# Altium schematic sheet MR-71_RE0.SchDoc: MR-71-RE0
size A3; Address1: BM8132.r; Address2: Draw By: OldGerman; SheetNumber: 1; SheetTotal: 1
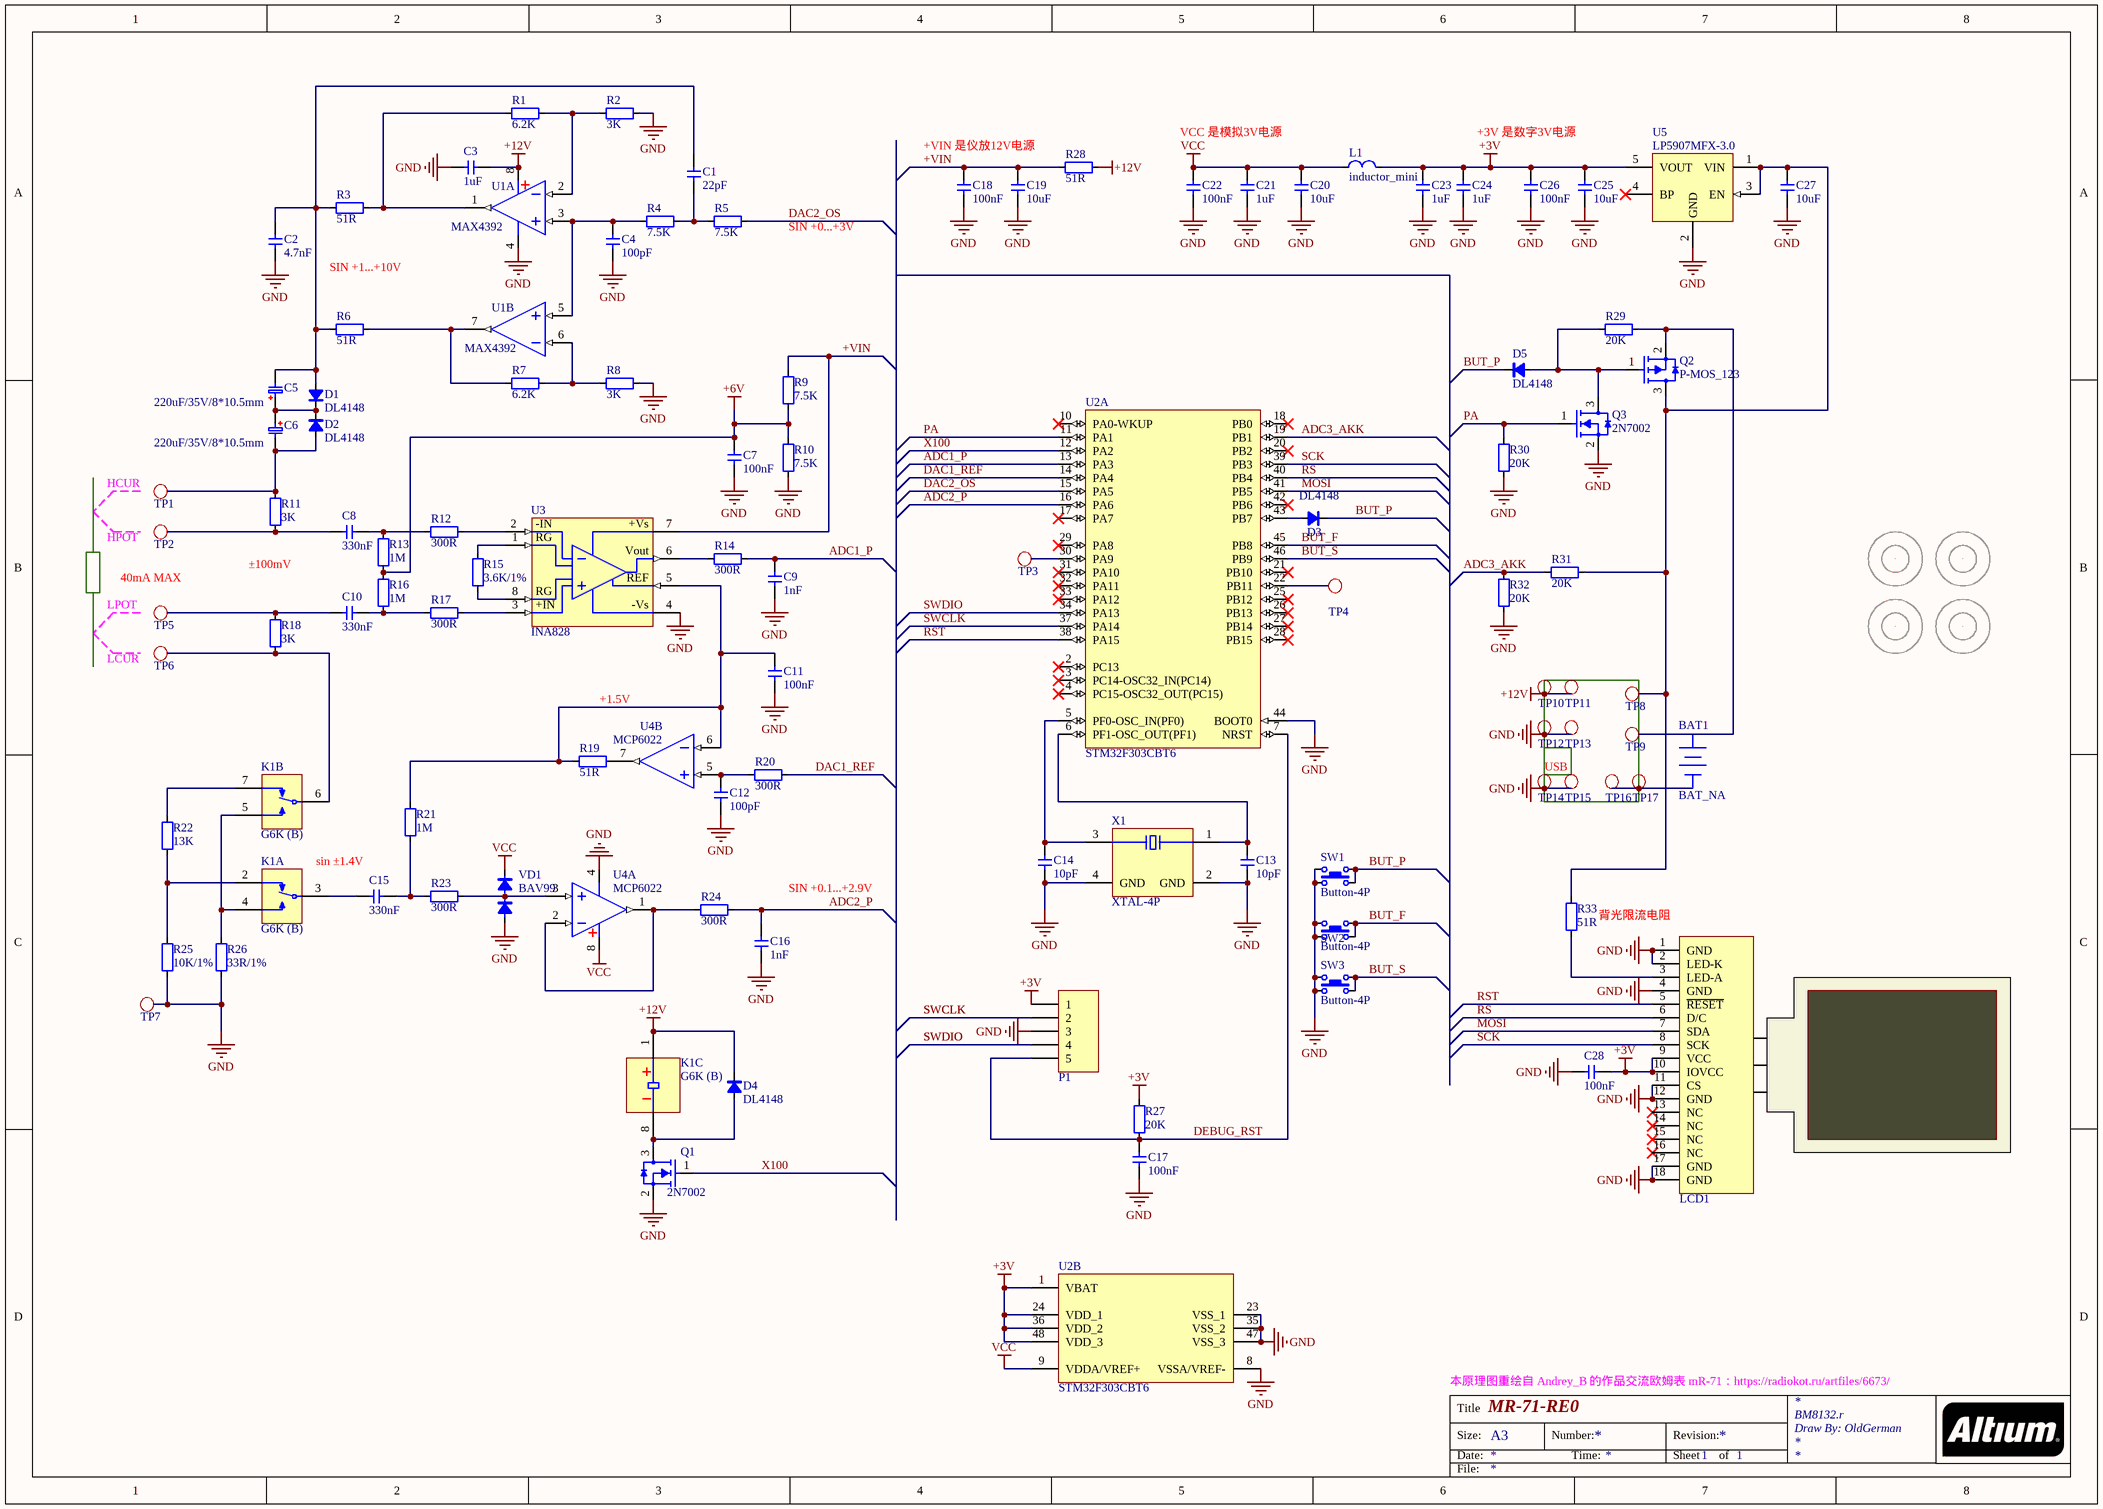
[diagram p0: MR-71_RE0.SchDoc]

## Parts
BAT1  BAT_NA  [Lipo_NONE]
C1  22pF  [C0805]
C2  4.7nF  [C0805]
C3  1uF  [C0805]
C4  100pF  [C0805]
C5  220uF/35V/8*10.5mm  [CAP OS-CON D=8.0 L=11.9 E12]
C6  220uF/35V/8*10.5mm  [CAP OS-CON D=8.0 L=11.9 E12]
C7  100nF  [C0805]
C8  330nF  [C0805]
C9  1nF  [C0805]
C10  330nF  [C0805]
C11  100nF  [C0805]
C12  100pF  [C0805]
C13  10pF  [C0805]
C14  10pF  [C0805]
C15  330nF  [C0805]
C16  1nF  [C0805]
C17  100nF  [C0805]
C18  100nF  [C0805]
C19  10uF  [C1206]
C20  10uF  [C1206]
C21  1uF  [C0805]
C22  100nF  [C0805]
C23  1uF  [C0805]
C24  1uF  [C0805]
C25  10uF  [C1206]
C26  100nF  [C0805]
C27  10uF  [C1206]
C28  100nF  [C0805]
D1  DL4148  [SOD-123]
D2  DL4148  [SOD-123]
D3  DL4148  [SOD-123]
D4  DL4148  [SOD-123]
D5  DL4148  [SOD-123]
H1  HOLE  [M3.1 D=5.8 SUN]  (value not drawn)
H2  HOLE  [M3.1 D=5.8 SUN]  (value not drawn)
H3  HOLE  [M3.1 D=5.8 SUN]  (value not drawn)
H4  HOLE  [M3.1 D=5.8 SUN]  (value not drawn)
K1  G6K (B)  [RELAY_G6K-2F-Y]  (parts A,B,C of 3)
L1  inductor_mini  [FER0805]
LCD1  LCD_Universal_128x160_18pin  [LCD-128X160-1.8INCH_SOLDER_MR-71]  (value not drawn)
P1  CONN_X5  [2.54MM_MALE_X5]  (value not drawn)
Q1  2N7002  [INFINEON SOT-23-3]
Q2  P-MOS_123  [INFINEON SOT-23-3]
Q3  2N7002  [INFINEON SOT-23-3]
R1  6.2K  [R0805]
R2  3K  [R0805]
R3  51R  [R0805]
R4  7.5K  [R0805]
R5  7.5K  [R0805]
R6  51R  [R0805]
R7  6.2K  [R0805]
R8  3K  [R0805]
R9  7.5K  [R0805]
R10  7.5K  [R0805]
R11  3K  [R0805]
R12  300R  [R0805]
R13  1M  [R0805]
R14  300R  [R0805]
R15  3.6K/1%  [R0805]
R16  1M  [R0805]
R17  300R  [R0805]
R18  3K  [R0805]
R19  51R  [R0805]
R20  300R  [R0805]
R21  1M  [R0805]
R22  13K  [R0805]
R23  300R  [R0805]
R24  300R  [R0805]
R25  10K/1%  [R0805]
R26  33R/1%  [R1206]
R27  20K  [R0805]
R28  51R  [R0805]
R29  20K  [R0805]
R30  20K  [R0805]
R31  20K  [R0805]
R32  20K  [R0805]
R33  51R  [R0805]
SW1  Button-4P  [TACTILE_SWITCH_SMD_4X4MM]
SW2  Button-4P  [TACTILE_SWITCH_SMD_4X4MM]
SW3  Button-4P  [TACTILE_SWITCH_SMD_4X4MM]
TP1  TP_SMD  [TP_SMD_1.5mm_01]  (value not drawn)  (no BOM)
TP2  TP_SMD  [TP_SMD_1.5mm_01]  (value not drawn)  (no BOM)
TP3  TP_SMD  [TP_SMD_1.5mm_01]  (value not drawn)  (no BOM)
TP4  TP_SMD  [TP_SMD_1.5mm_01]  (value not drawn)  (no BOM)
TP5  TP_SMD  [TP_SMD_1.5mm_01]  (value not drawn)  (no BOM)
TP6  TP_SMD  [TP_SMD_1.5mm_01]  (value not drawn)  (no BOM)
TP7  TP_SMD  [TP_SMD_1.5mm_01]  (value not drawn)  (no BOM)
TP8  TP_SMD  [TP_SMD_1.5mm_01]  (value not drawn)  (no BOM)
TP9  TP_SMD  [TP_SMD_1.5mm_01]  (value not drawn)  (no BOM)
TP10  TP_SMD  [KEYSTONE_5015]  (value not drawn)  (no BOM)
TP11  TP_SMD  [KEYSTONE_5015]  (value not drawn)  (no BOM)
TP12  TP_SMD  [KEYSTONE_5015]  (value not drawn)  (no BOM)
TP13  TP_SMD  [KEYSTONE_5015]  (value not drawn)  (no BOM)
TP14  TP_SMD  [KEYSTONE_5015]  (value not drawn)  (no BOM)
TP15  TP_SMD  [KEYSTONE_5015]  (value not drawn)  (no BOM)
TP16  TP_SMD  [KEYSTONE_5015]  (value not drawn)  (no BOM)
TP17  TP_SMD  [KEYSTONE_5015]  (value not drawn)  (no BOM)
U1  MAX4392  [ANALOG DEV SOIC-8 R8]  (parts A,B of 2)
U2  STM32F303CBT6  [ST LQFP-48 7x7MM]  (parts A,B of 2)
U3  INA828  [ANALOG DEV SOIC-8 R8]
U4  MCP6022  [ANALOG DEV SOIC-8 R8]  (parts A,B of 2)
U5  LP5907MFX-3.0  [ANALOG TSOT-23-5 UJ-5]
VD1  BAV99  [INFINEON SOT-23-3]
X1  XTAL-4P  [EPSON TSX-3225]

## Blocks framed on the sheet
USB: TP10-TP16

## Nets
+3V: C23.1 C24.1 C25.1 C26.1 C28.2 L1.2 LCD1.9(VCC) LCD1.10(IOVCC) P1.1 R27.2 U2.1(VBAT) U2.24(VDD_1) U2.36(VDD_2) U2.48(VDD_3) U5.5(VOUT)
+6V: C7.1 R9.1 R10.2 R13.2 R16.1
+12V: C3.2 D4.2(C) K1.1 R28.2 TP10.1 TP11.1 U1.8(V+)
GND: C2.2 C3.1 C4.2 C7.2 C9.2 C11.2 C12.2 C13.1 C14.1 C16.1 C17.1 C18.2 C19.2 C20.2 C21.2 C22.2 C23.2 C24.2 C25.2 C26.2 C27.2 C28.1 LCD1.1(GND) LCD1.2(LED-K) LCD1.4(GND) LCD1.11(CS) LCD1.12(GND) LCD1.17(GND) LCD1.18(GND) P1.3 Q1.2(S) Q3.2(S) R2.2 R8.2 R10.1 R25.2 R26.2 R30.2 R32.2 SW1.1 SW1.2 SW2.1 SW2.2 SW3.1 SW3.2 TP7.1 TP12.1 TP13.1 TP14.1 TP15.1 U1.4(V-) U2.8(VSSA/VREF-) U2.23(VSS_1) U2.35(VSS_2) U2.44(BOOT0) U2.47(VSS_3) U3.4(-Vs) U4.4(V-) U5.2(GND) VD1.1 X1.2(GND) X1.4(GND)
VCC: C20.1 C21.1 C22.1 L1.1 U2.9(VDDA/VREF+) U4.8(V+) VD1.2
+VIN: C18.1 C19.1 R9.2 R28.1 U3.7(+Vs)
ADC1_P: C9.1 R14.1 U2.13(PA3)
ADC2_P: C16.2 R24.1 U2.16(PA6)
ADC3_AKK: R31.1 R32.1 U2.19(PB1)
BUT_F: SW2.3 SW2.4 U2.45(PB8)
BUT_P: D3.2(C) D5.2(C) SW1.3 SW1.4
BUT_S: SW3.3 SW3.4 U2.46(PB9)
DAC1_REF: R20.1 U2.14(PA4)
DAC2_OS: R5.2 U2.15(PA5)
DEBUG_RST: C17.2 P1.5 R27.1 U2.7(NRST)
MOSI: LCD1.7(SDA) U2.41(PB5)
PA: Q3.1(G) R30.1 U2.11(PA1)
RS: LCD1.6(D/C) U2.40(PB4)
RST: LCD1.5(~{RESE}~{T}) U2.38(PA15)
SCK: LCD1.8(SCK) U2.39(PB3)
SWCLK: P1.2 U2.37(PA14)
SWDIO: P1.4 U2.34(PA13)
X100: Q1.1(G) U2.12(PA2)
NetC1_1: C1.1 C2.1 C5.2 D1.1(A) R3.1 R6.1
NetC1_2: C1.2 R4.2 R5.1
NetC4_1: C4.1 R4.1 U1.3(+) U1.5(+)
NetC5_1: C5.1 C6.1 D1.2(C) D2.2(C)
NetC6_2: C6.2 D2.1(A) R11.1 TP1.1
NetC8_1: C8.1 R12.2 R13.1
NetC8_2: C8.2 R11.2 TP2.1
NetC10_1: C10.1 R16.2 R17.2
NetC10_2: C10.2 R18.1 TP5.1
NetC11_1: C11.1 R19.1 R21.1 U3.5(REF) U4.6(-)
NetC12_1: C12.1 R20.2 U4.5(+)
NetC13_2: C13.2 U2.6(PF1-OSC_OUT(PF1)) X1.1
NetC14_2: C14.2 U2.5(PF0-OSC_IN(PF0)) X1.3
NetC15_1: C15.1 R21.2 R23.2
NetC15_2: C15.2 K1.3
NetC27_1: C27.1 Q2.3(D) R31.2 R33.2 TP8.1 U5.1(VIN) U5.3(EN)
NetD3_1: D3.1(A) U2.43(PB7)
NetD4_1: D4.1(A) K1.8 Q1.3(D)
NetD5_1: D5.1(A) Q2.1(G) Q3.3(D) R29.1
NetK1_2: K1.2 R22.2 R25.1
NetK1_4: K1.4 K1.5 R26.1
NetK1_6: K1.6 R18.2 TP6.1
NetK1_7: K1.7 R22.1
NetLCD1_3: LCD1.3(LED-A) R33.1
NetQ2_2: Q2.2(S) R29.2 TP9.1
NetR1_1: R1.1 R3.2 U1.1(OUT1)
NetR1_2: R1.2 R2.1 U1.2(-)
NetR6_2: R6.2 R7.1 U1.7(OUT2)
NetR7_2: R7.2 R8.1 U1.6(-)
NetR12_1: R12.1 U3.2(-IN)
NetR14_2: R14.2 U3.6(Vout)
NetR15_1: R15.1 U3.1(RG)
NetR15_2: R15.2 U3.8(RG)
NetR17_1: R17.1 U3.3(+IN)
NetR19_2: R19.2 U4.7(OUT2)
NetR23_1: R23.1 U4.3(+) VD1.3
NetR24_2: R24.2 U4.1(OUT1) U4.2(-)
NetTP3_1: TP3.1 U2.30(PA9)
NetTP4_1: TP4.1 U2.22(PB11)
NetTP16_1: TP16.1 TP17.1

Not connected (* = marked no-connect by the designer): H1 1; H2 1; H3 1; H4 1; LCD1 13(NC)* 14(NC)* 15(NC)* 16(NC)*; U2 2(PC13)* 3(PC14-OSC32_IN(PC14))* 4(PC15-OSC32_OUT(PC15))* 10(PA0-WKUP)* 17(PA7)* 18(PB0)* 20(PB2)* 21(PB10)* 25(PB12)* 26(PB13)* 27(PB14)* 28(PB15)* 29(PA8)* 31(PA10)* 32(PA11)* 33(PA12)* 42(PB6)*; U5 4(BP)*

## Notes on the sheet
- +VIN 是仪放12V电源
- VCC 是模拟3V电源
- +3V 是数字3V电源
- (near R5) SIN +0...+3V
- SIN +1...+10V
- HCUR
- HPOT
- 40mA MAX
- ±100mV
- LPOT
- LCUR
- +1.5V
- sin ±1.4V
- SIN +0.1...+2.9V
- (near R33) 背光限流电阻
- 本原理图重绘自 Andrey_B 的作品交流欧姆表 mR-71：https://radiokot.ru/artfiles/6673/
- Title
- Size:
- Date:
- A3
- Number:
- Time:
- Revision:
- Sheet
- of
- File:

## Library data of the parts
BAT1 = BAT_NA: 锂电池
C1-C4 C7-C28 = CAP: Capacitor
C5 C6 = CAP_Polar_Aluminum: Capacitor
D1-D5 = DIODE: 二极管
K1 = G6K (B): Telecom Relay DPDT (2 Form C) Surface Mount; MF: Omron Electronics; MP: G6K-2F DC3; Package: None; Availability: Unavailable; Value: *; Check_prices: https://www.snapeda.com/parts/G6K-2F%20DC3/Omron%20Electronics%20Inc-EMC%20Div/view-part/394711/?ref=eda; Price: None; SnapEDA_Link: https://www.snapeda.com/parts/G6K-2F%20DC3/Omron%20Electronics%20Inc-EMC%20Div/view-part/394711/?ref=snap
L1 = inductor_mini: 贴片叠层电感
Q1 Q3 = N-MOS_123: N-MOS
Q2 = P-MOS_123: P-MOS
R1-R33 = RES: IEC Standard
SW1-SW3 = Button-4P: Button
TP1-TP17 = TP_SMD: SMD testpad; ComponentLink1Description: Datasheet; ComponentLink2Description: Supplier link
U1 = AD8542: 通用型CMOS双路轨到轨放大器 / General-Purpose CMOS Dual Rail-to-Rail Amplifier; ComponentLink1Description: 中文数据手册; ComponentLink1URL: https://www.analog.com/media/cn/technical-documentation/data-sheets/AD8541_8542_8544_cn.pdf; ComponentLink2Description: Data Sheet; ComponentLink2URL: https://www.analog.com/media/en/technical-documentation/data-sheets/AD8541_8542_8544.pdf
U2 = STM32F303CBT6: 带DSP和FPU的主流混合信号ARM Cortex-M4 MCU，具有128 KB Flash、72 MHz CPU、MPU、CCM、5 MSPS 12位ADC、PGA和比较器; PartNumber: STM32F103CBT6; A/D Converter: 2x12-bit (10 Channel); Core: ARM Cortex-M3; FLASH Size (Prog) (kB): 128; I/Os (High Current): 37; Internal RAM Size (kB): 20; Operating Frequency(F) (Processor speed) (MHz): 72; Supply Voltage(Vcc) min (V): 2; Packing: Tray; DatasheetVersion: Rev. 16; PackageVersion: Rev. 6, 06/2013; PackageReference: LQFP48; PackageDescription: 48-Pin Low Profile Quad Flat Package, 7 x 7 mm Body, 0.5 mm Pitch; Supplier 1: Digi-Key; Supplier Part Number 1: 497-6288-ND; Supplier 2: Farnell; Supplier Part Number 2: 1606327; Supplier 3: Newark; Supplier Part Number 3: 11N8296; Supplier 4: Newark; Supplier Part Number 4: 57P1214; Supplier 5: Mouser; Mounting Technology: Surface Mount; ComponentLink1Description: 数据手册; ComponentLink1URL: https://www.st.com/resource/en/datasheet/stm32f303cb.pdf; Supplier Part Number 5: 511-STM32F103CBT6
U3 = INA828: 50-µV Offset, 7-nV/√Hz Noise, Low-Power, Precision Instrumentation Amplifier
U4 = AD8542: ComponentLink1Description: 中文数据手册; ComponentLink1URL: https://www.analog.com/media/cn/technical-documentation/data-sheets/AD8541_8542_8544_cn.pdf; ComponentLink2Description: Data Sheet; ComponentLink2URL: https://www.analog.com/media/en/technical-documentation/data-sheets/AD8541_8542_8544.pdf
U5 = ADP150AUJZ-3.3-R7: 超低噪声线性稳压芯片
VD1 = BAV99: Dual Series Switching Diodes; ComponentLink1Description: Datasheet; ComponentLink1URL: https://www.onsemi.com/pub/Collateral/BAV99WT1-D.PDF
X1 = XTAL-4P_crystal: 4脚无源石英晶振